# EAGLE design 10-de-77 (EAGLE 6.6.0)
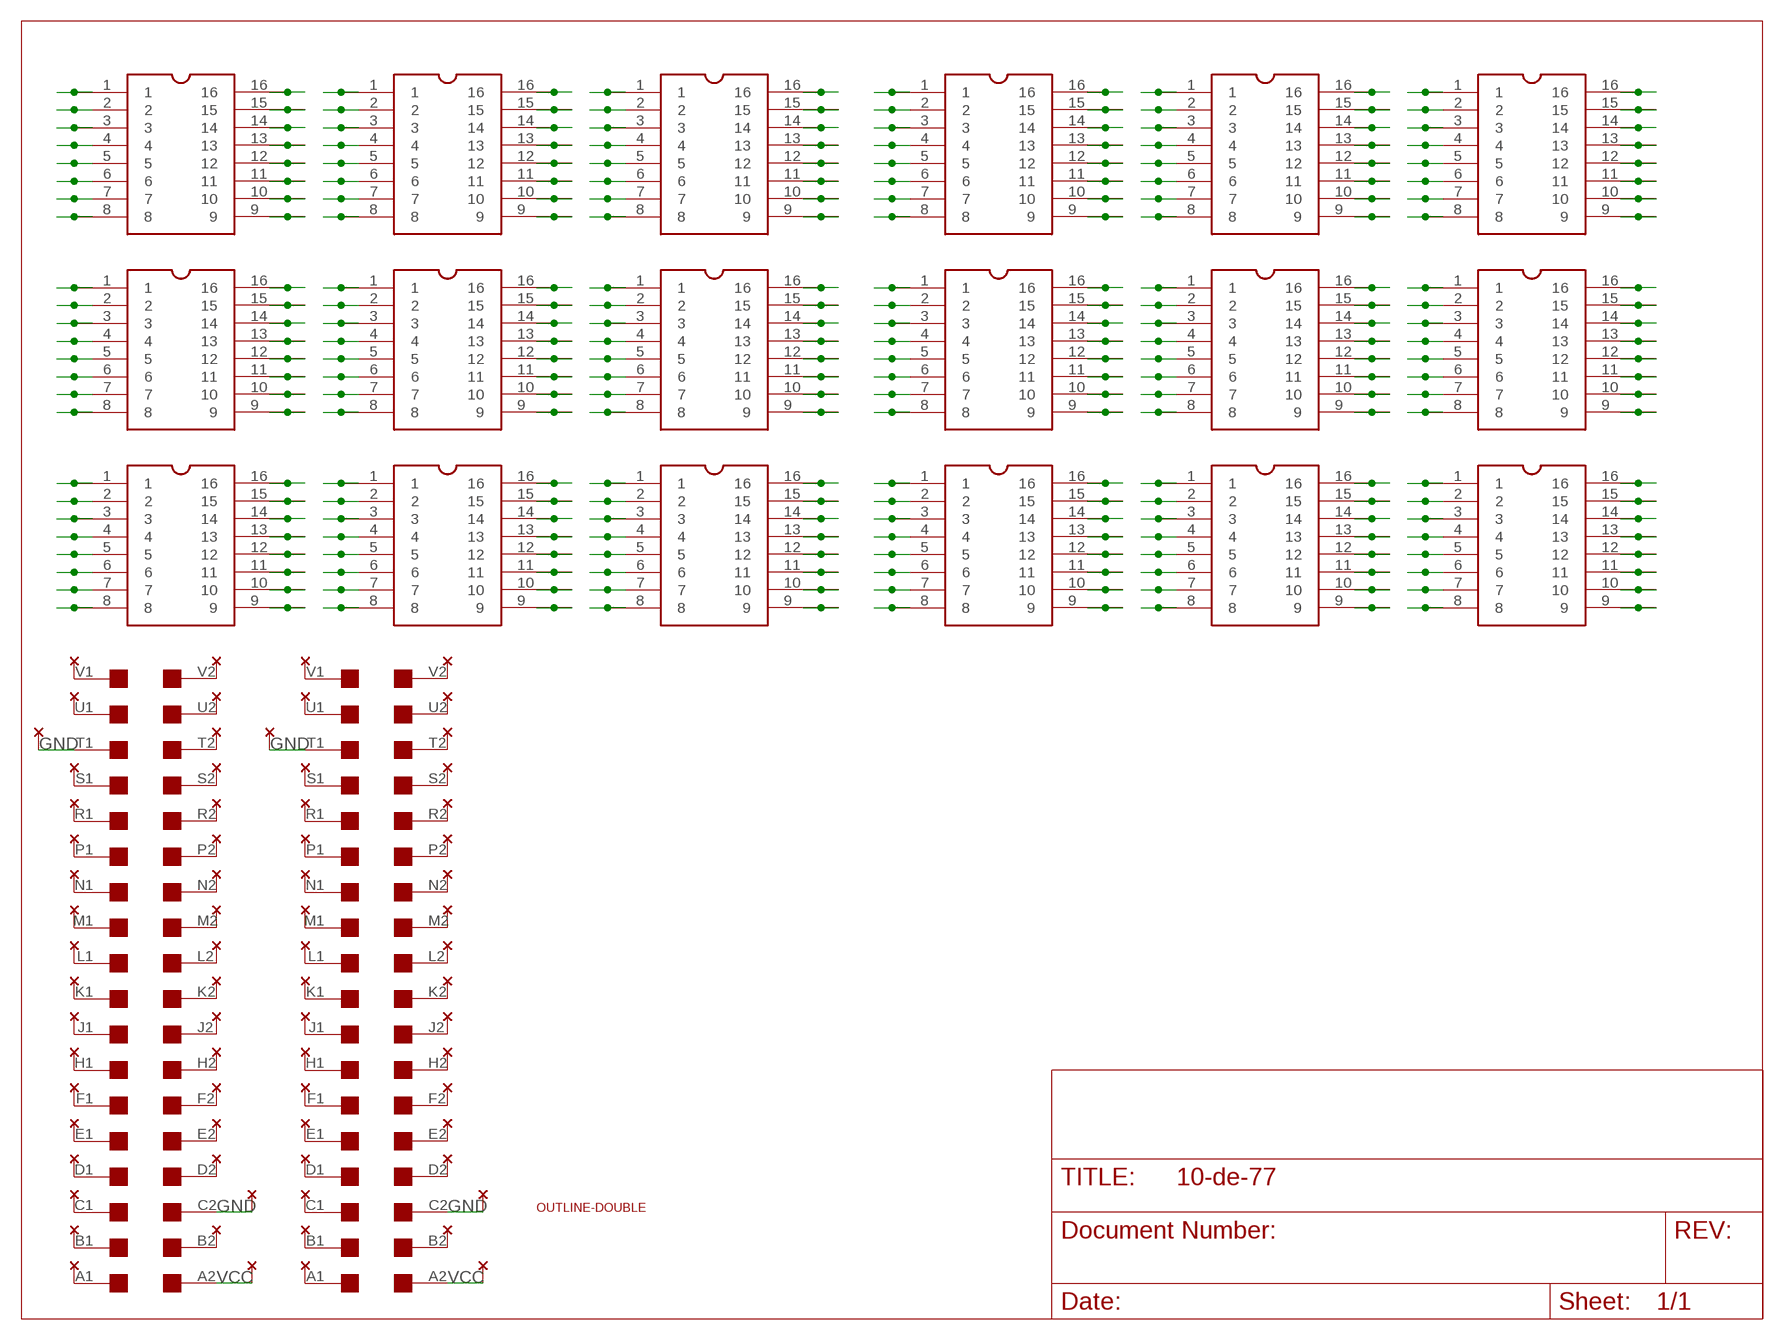
[diagram p0: schematic, sheet 1]

## Parts
U$1  SINGLE  [EDGE-CON2]
U$4  OUTLINE-DOUBLE  [DOUBLE]
U$5  DIL16PROTO  [DIL16PROTO]
U$6  SINGLE  [EDGE-CON2]
U$7  DIL16PROTO  [DIL16PROTO]
U$8  DIL16PROTO  [DIL16PROTO]
U$9  DIL16PROTO  [DIL16PROTO]
U$10  DIL16PROTO  [DIL16PROTO]
U$11  DIL16PROTO  [DIL16PROTO]
U$12  DIL16PROTO  [DIL16PROTO]
U$13  DIL16PROTO  [DIL16PROTO]
U$14  DIL16PROTO  [DIL16PROTO]
U$15  DIL16PROTO  [DIL16PROTO]
U$16  DIL16PROTO  [DIL16PROTO]
U$17  DIL16PROTO  [DIL16PROTO]
U$18  DIL16PROTO  [DIL16PROTO]
U$19  DIL16PROTO  [DIL16PROTO]
U$20  DIL16PROTO  [DIL16PROTO]
U$21  DIL16PROTO  [DIL16PROTO]
U$22  DIL16PROTO  [DIL16PROTO]
U$23  DIL16PROTO  [DIL16PROTO]
U$24  THRU-HOLE1A  [THRU-HOLE1A]
U$25  THRU-HOLE1A  [THRU-HOLE1A]
U$26  THRU-HOLE1A  [THRU-HOLE1A]
U$27  THRU-HOLE1A  [THRU-HOLE1A]

## Nets
GND: U$1.C2 U$1.T1 U$6.C2 U$6.T1 U$24.T1 U$25.C1 U$26.T1 U$27.C1
N$1: U$1.K2 U$25.K1
N$2: U$1.J2 U$25.J1
N$3: U$1.H2 U$25.H1
N$4: U$1.L2 U$25.L1
N$5: U$1.M2 U$25.M1
N$6: U$1.N2 U$25.N1
N$7: U$1.P2 U$25.P1
N$8: U$1.F2 U$25.F1
N$9: U$1.E2 U$25.E1
N$10: U$1.D2 U$25.D1
N$12: U$1.R2 U$25.R1
N$13: U$1.S2 U$25.S1
N$14: U$1.B2 U$25.B1
N$16: U$1.T2 U$25.T1
N$17: U$1.U2 U$25.U1
N$18: U$1.V2 U$25.V1
N$19: U$1.A1 U$24.A1
N$20: U$1.V1 U$24.V1
N$21: U$1.U1 U$24.U1
N$23: U$1.S1 U$24.S1
N$24: U$1.R1 U$24.R1
N$25: U$1.P1 U$24.P1
N$26: U$1.N1 U$24.N1
N$27: U$1.M1 U$24.M1
N$28: U$1.L1 U$24.L1
N$29: U$1.K1 U$24.K1
N$30: U$1.J1 U$24.J1
N$31: U$1.H1 U$24.H1
N$32: U$1.F1 U$24.F1
N$33: U$1.E1 U$24.E1
N$34: U$1.D1 U$24.D1
N$35: U$1.C1 U$24.C1
N$36: U$1.B1 U$24.B1
N$37: U$6.K2 U$27.K1
N$38: U$6.J2 U$27.J1
N$39: U$6.H2 U$27.H1
N$40: U$6.L2 U$27.L1
N$41: U$6.M2 U$27.M1
N$42: U$6.N2 U$27.N1
N$43: U$6.P2 U$27.P1
N$44: U$6.F2 U$27.F1
N$45: U$6.E2 U$27.E1
N$46: U$6.D2 U$27.D1
N$48: U$6.R2 U$27.R1
N$49: U$6.S2 U$27.S1
N$50: U$6.B2 U$27.B1
N$52: U$6.T2 U$27.T1
N$53: U$6.U2 U$27.U1
N$54: U$6.V2 U$27.V1
N$55: U$6.A1 U$26.A1
N$56: U$6.V1 U$26.V1
N$57: U$6.U1 U$26.U1
N$59: U$6.S1 U$26.S1
N$60: U$6.R1 U$26.R1
N$61: U$6.P1 U$26.P1
N$62: U$6.N1 U$26.N1
N$63: U$6.M1 U$26.M1
N$64: U$6.L1 U$26.L1
N$65: U$6.K1 U$26.K1
N$66: U$6.J1 U$26.J1
N$67: U$6.H1 U$26.H1
N$68: U$6.F1 U$26.F1
N$69: U$6.E1 U$26.E1
N$70: U$6.D1 U$26.D1
N$71: U$6.C1 U$26.C1
N$72: U$6.B1 U$26.B1
N$73: U$5.1 U$5.1@2 U$5.1@3
N$74: U$5.4 U$5.4@2 U$5.4@3
N$75: U$5.2 U$5.2@2 U$5.2@3
N$76: U$5.3 U$5.3@2 U$5.3@3
N$77: U$5.5 U$5.5@2 U$5.5@3
N$78: U$5.6 U$5.6@2 U$5.6@3
N$79: U$5.7 U$5.7@2 U$5.7@3
N$80: U$5.8 U$5.8@2 U$5.8@3
N$81: U$5.16 U$5.16@2 U$5.16@3
N$82: U$5.15 U$5.15@2 U$5.15@3
N$83: U$5.14 U$5.14@2 U$5.14@3
N$84: U$5.13 U$5.13@2 U$5.13@3
N$85: U$5.12 U$5.12@2 U$5.12@3
N$86: U$5.11 U$5.11@2 U$5.11@3
N$87: U$5.10 U$5.10@2 U$5.10@3
N$88: U$5.9 U$5.9@2 U$5.9@3
N$89: U$7.1 U$7.1@2 U$7.1@3
N$90: U$7.2 U$7.2@2 U$7.2@3
N$91: U$7.3 U$7.3@2 U$7.3@3
N$92: U$7.4 U$7.4@2 U$7.4@3
N$93: U$7.5 U$7.5@2 U$7.5@3
N$94: U$7.6 U$7.6@2 U$7.6@3
N$95: U$7.7 U$7.7@2 U$7.7@3
N$96: U$7.8 U$7.8@2 U$7.8@3
N$97: U$7.16 U$7.16@2 U$7.16@3
N$98: U$7.15 U$7.15@2 U$7.15@3
N$99: U$7.14 U$7.14@2 U$7.14@3
N$100: U$7.13 U$7.13@2 U$7.13@3
N$101: U$7.12 U$7.12@2 U$7.12@3
N$102: U$7.11 U$7.11@2 U$7.11@3
N$103: U$7.10 U$7.10@2 U$7.10@3
N$104: U$7.9 U$7.9@2 U$7.9@3
N$105: U$8.1 U$8.1@2 U$8.1@3
N$106: U$8.2 U$8.2@2 U$8.2@3
N$107: U$8.3 U$8.3@2 U$8.3@3
N$108: U$8.4 U$8.4@2 U$8.4@3
N$109: U$8.5 U$8.5@2 U$8.5@3
N$110: U$8.6 U$8.6@2 U$8.6@3
N$111: U$8.7 U$8.7@2 U$8.7@3
N$112: U$8.8 U$8.8@2 U$8.8@3
N$113: U$8.16 U$8.16@2 U$8.16@3
N$114: U$8.15 U$8.15@2 U$8.15@3
N$115: U$8.14 U$8.14@2 U$8.14@3
N$116: U$8.13 U$8.13@2 U$8.13@3
N$117: U$8.12 U$8.12@2 U$8.12@3
N$118: U$8.11 U$8.11@2 U$8.11@3
N$119: U$8.10 U$8.10@2 U$8.10@3
N$120: U$8.9 U$8.9@2 U$8.9@3
N$121: U$9.1 U$9.1@2 U$9.1@3
N$122: U$9.2 U$9.2@2 U$9.2@3
N$123: U$9.3 U$9.3@2 U$9.3@3
N$124: U$9.4 U$9.4@2 U$9.4@3
N$125: U$9.5 U$9.5@2 U$9.5@3
N$126: U$9.6 U$9.6@2 U$9.6@3
N$127: U$9.7 U$9.7@2 U$9.7@3
N$128: U$9.8 U$9.8@2 U$9.8@3
N$129: U$9.16 U$9.16@2 U$9.16@3
N$130: U$9.15 U$9.15@2 U$9.15@3
N$131: U$9.14 U$9.14@2 U$9.14@3
N$132: U$9.13 U$9.13@2 U$9.13@3
N$133: U$9.12 U$9.12@2 U$9.12@3
N$134: U$9.11 U$9.11@2 U$9.11@3
N$135: U$9.10 U$9.10@2 U$9.10@3
N$136: U$9.9 U$9.9@2 U$9.9@3
N$137: U$10.1 U$10.1@2 U$10.1@3
N$138: U$10.2 U$10.2@2 U$10.2@3
N$139: U$10.3 U$10.3@2 U$10.3@3
N$140: U$10.4 U$10.4@2 U$10.4@3
N$141: U$10.5 U$10.5@2 U$10.5@3
N$142: U$10.6 U$10.6@2 U$10.6@3
N$143: U$10.7 U$10.7@2 U$10.7@3
N$144: U$10.8 U$10.8@2 U$10.8@3
N$145: U$10.16 U$10.16@2 U$10.16@3
N$146: U$10.15 U$10.15@2 U$10.15@3
N$147: U$10.14 U$10.14@2 U$10.14@3
N$148: U$10.13 U$10.13@2 U$10.13@3
N$149: U$10.12 U$10.12@2 U$10.12@3
N$150: U$10.11 U$10.11@2 U$10.11@3
N$151: U$10.10 U$10.10@2 U$10.10@3
N$152: U$10.9 U$10.9@2 U$10.9@3
N$153: U$11.1 U$11.1@2 U$11.1@3
N$154: U$11.2 U$11.2@2 U$11.2@3
N$155: U$11.3 U$11.3@2 U$11.3@3
N$156: U$11.4 U$11.4@2 U$11.4@3
N$157: U$11.5 U$11.5@2 U$11.5@3
N$158: U$11.6 U$11.6@2 U$11.6@3
N$159: U$11.7 U$11.7@2 U$11.7@3
N$160: U$11.8 U$11.8@2 U$11.8@3
N$161: U$11.16 U$11.16@2 U$11.16@3
N$162: U$11.15 U$11.15@2 U$11.15@3
N$163: U$11.14 U$11.14@2 U$11.14@3
N$164: U$11.13 U$11.13@2 U$11.13@3
N$165: U$11.12 U$11.12@2 U$11.12@3
N$166: U$11.11 U$11.11@2 U$11.11@3
N$167: U$11.10 U$11.10@2 U$11.10@3
N$168: U$11.9 U$11.9@2 U$11.9@3
N$169: U$12.1 U$12.1@2 U$12.1@3
N$170: U$12.2 U$12.2@2 U$12.2@3
N$171: U$12.3 U$12.3@2 U$12.3@3
N$172: U$12.4 U$12.4@2 U$12.4@3
N$173: U$12.5 U$12.5@2 U$12.5@3
N$174: U$12.6 U$12.6@2 U$12.6@3
N$175: U$12.7 U$12.7@2 U$12.7@3
N$176: U$12.8 U$12.8@2 U$12.8@3
N$177: U$12.16 U$12.16@2 U$12.16@3
N$178: U$12.15 U$12.15@2 U$12.15@3
N$179: U$12.14 U$12.14@2 U$12.14@3
N$180: U$12.13 U$12.13@2 U$12.13@3
N$181: U$12.12 U$12.12@2 U$12.12@3
N$182: U$12.11 U$12.11@2 U$12.11@3
N$183: U$12.10 U$12.10@2 U$12.10@3
N$184: U$12.9 U$12.9@2 U$12.9@3
N$185: U$13.1 U$13.1@2 U$13.1@3
N$186: U$13.2 U$13.2@2 U$13.2@3
N$187: U$13.3 U$13.3@2 U$13.3@3
N$188: U$13.4 U$13.4@2 U$13.4@3
N$189: U$13.5 U$13.5@2 U$13.5@3
N$190: U$13.6 U$13.6@2 U$13.6@3
N$191: U$13.7 U$13.7@2 U$13.7@3
N$192: U$13.8 U$13.8@2 U$13.8@3
N$193: U$13.16 U$13.16@2 U$13.16@3
N$194: U$13.15 U$13.15@2 U$13.15@3
N$195: U$13.14 U$13.14@2 U$13.14@3
N$196: U$13.13 U$13.13@2 U$13.13@3
N$197: U$13.12 U$13.12@2 U$13.12@3
N$198: U$13.11 U$13.11@2 U$13.11@3
N$199: U$13.10 U$13.10@2 U$13.10@3
N$200: U$13.9 U$13.9@2 U$13.9@3
N$201: U$14.1 U$14.1@2 U$14.1@3
N$202: U$14.2 U$14.2@2 U$14.2@3
N$203: U$14.3 U$14.3@2 U$14.3@3
N$204: U$14.4 U$14.4@2 U$14.4@3
N$205: U$14.5 U$14.5@2 U$14.5@3
N$206: U$14.6 U$14.6@2 U$14.6@3
N$207: U$14.7 U$14.7@2 U$14.7@3
N$208: U$14.8 U$14.8@2 U$14.8@3
N$209: U$14.16 U$14.16@2 U$14.16@3
N$210: U$14.15 U$14.15@2 U$14.15@3
N$211: U$14.14 U$14.14@2 U$14.14@3
N$212: U$14.13 U$14.13@2 U$14.13@3
N$213: U$14.12 U$14.12@2 U$14.12@3
N$214: U$14.11 U$14.11@2 U$14.11@3
N$215: U$14.10 U$14.10@2 U$14.10@3
N$216: U$14.9 U$14.9@2 U$14.9@3
N$217: U$15.1 U$15.1@2 U$15.1@3
N$218: U$15.2 U$15.2@2 U$15.2@3
N$219: U$15.3 U$15.3@2 U$15.3@3
N$220: U$15.4 U$15.4@2 U$15.4@3
N$221: U$15.5 U$15.5@2 U$15.5@3
N$222: U$15.6 U$15.6@2 U$15.6@3
N$223: U$15.7 U$15.7@2 U$15.7@3
N$224: U$15.8 U$15.8@2 U$15.8@3
N$225: U$15.16 U$15.16@2 U$15.16@3
N$226: U$15.15 U$15.15@2 U$15.15@3
N$227: U$15.14 U$15.14@2 U$15.14@3
N$228: U$15.13 U$15.13@2 U$15.13@3
N$229: U$15.12 U$15.12@2 U$15.12@3
N$230: U$15.11 U$15.11@2 U$15.11@3
N$231: U$15.10 U$15.10@2 U$15.10@3
N$232: U$15.9 U$15.9@2 U$15.9@3
N$233: U$16.1 U$16.1@2 U$16.1@3
N$234: U$16.2 U$16.2@2 U$16.2@3
N$235: U$16.3 U$16.3@2 U$16.3@3
N$236: U$16.4 U$16.4@2 U$16.4@3
N$237: U$16.5 U$16.5@2 U$16.5@3
N$238: U$16.6 U$16.6@2 U$16.6@3
N$239: U$16.7 U$16.7@2 U$16.7@3
N$240: U$16.8 U$16.8@2 U$16.8@3
N$241: U$16.16 U$16.16@2 U$16.16@3
N$242: U$16.15 U$16.15@2 U$16.15@3
N$243: U$16.14 U$16.14@2 U$16.14@3
N$244: U$16.13 U$16.13@2 U$16.13@3
N$245: U$16.12 U$16.12@2 U$16.12@3
N$246: U$16.11 U$16.11@2 U$16.11@3
N$247: U$16.10 U$16.10@2 U$16.10@3
N$248: U$16.9 U$16.9@2 U$16.9@3
N$249: U$17.1 U$17.1@2 U$17.1@3
N$250: U$17.2 U$17.2@2 U$17.2@3
N$251: U$17.3 U$17.3@2 U$17.3@3
N$252: U$17.4 U$17.4@2 U$17.4@3
N$253: U$17.5 U$17.5@2 U$17.5@3
N$254: U$17.6 U$17.6@2 U$17.6@3
N$255: U$17.7 U$17.7@2 U$17.7@3
N$256: U$17.8 U$17.8@2 U$17.8@3
N$257: U$17.16 U$17.16@2 U$17.16@3
N$258: U$17.15 U$17.15@2 U$17.15@3
N$259: U$17.14 U$17.14@2 U$17.14@3
N$260: U$17.13 U$17.13@2 U$17.13@3
N$261: U$17.12 U$17.12@2 U$17.12@3
N$262: U$17.11 U$17.11@2 U$17.11@3
N$263: U$17.10 U$17.10@2 U$17.10@3
N$264: U$17.9 U$17.9@2 U$17.9@3
N$265: U$18.1 U$18.1@2 U$18.1@3
N$266: U$18.2 U$18.2@2 U$18.2@3
N$267: U$18.3 U$18.3@2 U$18.3@3
N$268: U$18.4 U$18.4@2 U$18.4@3
N$269: U$18.5 U$18.5@2 U$18.5@3
N$270: U$18.6 U$18.6@2 U$18.6@3
N$271: U$18.7 U$18.7@2 U$18.7@3
N$272: U$18.8 U$18.8@2 U$18.8@3
N$273: U$18.16 U$18.16@2 U$18.16@3
N$274: U$18.15 U$18.15@2 U$18.15@3
N$275: U$18.14 U$18.14@2 U$18.14@3
N$276: U$18.13 U$18.13@2 U$18.13@3
N$277: U$18.12 U$18.12@2 U$18.12@3
N$278: U$18.11 U$18.11@2 U$18.11@3
N$279: U$18.10 U$18.10@2 U$18.10@3
N$280: U$18.9 U$18.9@2 U$18.9@3
N$281: U$19.1 U$19.1@2 U$19.1@3
N$282: U$19.2 U$19.2@2 U$19.2@3
N$283: U$19.3 U$19.3@2 U$19.3@3
N$284: U$19.4 U$19.4@2 U$19.4@3
N$285: U$19.5 U$19.5@2 U$19.5@3
N$286: U$19.6 U$19.6@2 U$19.6@3
N$287: U$19.7 U$19.7@2 U$19.7@3
N$288: U$19.8 U$19.8@2 U$19.8@3
N$289: U$19.16 U$19.16@2 U$19.16@3
N$290: U$19.15 U$19.15@2 U$19.15@3
N$291: U$19.14 U$19.14@2 U$19.14@3
N$292: U$19.13 U$19.13@2 U$19.13@3
N$293: U$19.12 U$19.12@2 U$19.12@3
N$294: U$19.11 U$19.11@2 U$19.11@3
N$295: U$19.10 U$19.10@2 U$19.10@3
N$296: U$19.9 U$19.9@2 U$19.9@3
N$297: U$20.1 U$20.1@2 U$20.1@3
N$298: U$20.2 U$20.2@2 U$20.2@3
N$299: U$20.3 U$20.3@2 U$20.3@3
N$300: U$20.4 U$20.4@2 U$20.4@3
N$301: U$20.5 U$20.5@2 U$20.5@3
N$302: U$20.6 U$20.6@2 U$20.6@3
N$303: U$20.7 U$20.7@2 U$20.7@3
N$304: U$20.8 U$20.8@2 U$20.8@3
N$305: U$20.16 U$20.16@2 U$20.16@3
N$306: U$20.15 U$20.15@2 U$20.15@3
N$307: U$20.14 U$20.14@2 U$20.14@3
N$308: U$20.13 U$20.13@2 U$20.13@3
N$309: U$20.12 U$20.12@2 U$20.12@3
N$310: U$20.11 U$20.11@2 U$20.11@3
N$311: U$20.10 U$20.10@2 U$20.10@3
N$312: U$20.9 U$20.9@2 U$20.9@3
N$313: U$21.1 U$21.1@2 U$21.1@3
N$314: U$21.2 U$21.2@2 U$21.2@3
N$315: U$21.3 U$21.3@2 U$21.3@3
N$316: U$21.4 U$21.4@2 U$21.4@3
N$317: U$21.5 U$21.5@2 U$21.5@3
N$318: U$21.6 U$21.6@2 U$21.6@3
N$319: U$21.7 U$21.7@2 U$21.7@3
N$320: U$21.8 U$21.8@2 U$21.8@3
N$321: U$21.16 U$21.16@2 U$21.16@3
N$322: U$21.15 U$21.15@2 U$21.15@3
N$323: U$21.14 U$21.14@2 U$21.14@3
N$324: U$21.13 U$21.13@2 U$21.13@3
N$325: U$21.12 U$21.12@2 U$21.12@3
N$326: U$21.11 U$21.11@2 U$21.11@3
N$327: U$21.10 U$21.10@2 U$21.10@3
N$328: U$21.9 U$21.9@2 U$21.9@3
N$329: U$22.1 U$22.1@2 U$22.1@3
N$330: U$22.2 U$22.2@2 U$22.2@3
N$331: U$22.3 U$22.3@2 U$22.3@3
N$332: U$22.4 U$22.4@2 U$22.4@3
N$333: U$22.5 U$22.5@2 U$22.5@3
N$334: U$22.6 U$22.6@2 U$22.6@3
N$335: U$22.7 U$22.7@2 U$22.7@3
N$336: U$22.8 U$22.8@2 U$22.8@3
N$337: U$22.16 U$22.16@2 U$22.16@3
N$338: U$22.15 U$22.15@2 U$22.15@3
N$339: U$22.14 U$22.14@2 U$22.14@3
N$340: U$22.13 U$22.13@2 U$22.13@3
N$341: U$22.12 U$22.12@2 U$22.12@3
N$342: U$22.11 U$22.11@2 U$22.11@3
N$343: U$22.10 U$22.10@2 U$22.10@3
N$344: U$22.9 U$22.9@2 U$22.9@3
N$345: U$23.1 U$23.1@2 U$23.1@3
N$346: U$23.2 U$23.2@2 U$23.2@3
N$347: U$23.3 U$23.3@2 U$23.3@3
N$348: U$23.4 U$23.4@2 U$23.4@3
N$349: U$23.5 U$23.5@2 U$23.5@3
N$350: U$23.6 U$23.6@2 U$23.6@3
N$351: U$23.7 U$23.7@2 U$23.7@3
N$352: U$23.8 U$23.8@2 U$23.8@3
N$353: U$23.16 U$23.16@2 U$23.16@3
N$354: U$23.15 U$23.15@2 U$23.15@3
N$355: U$23.14 U$23.14@2 U$23.14@3
N$356: U$23.13 U$23.13@2 U$23.13@3
N$357: U$23.12 U$23.12@2 U$23.12@3
N$358: U$23.11 U$23.11@2 U$23.11@3
N$359: U$23.10 U$23.10@2 U$23.10@3
N$360: U$23.9 U$23.9@2 U$23.9@3
VCC: U$1.A2 U$6.A2 U$25.A1 U$27.A1

## Library data of the parts
U$1 U$6 = dec-con:SINGLE: Single-Height DEC board
U$4 = dec-con:OUTLINE-*: Board outlines for DEC boards.
U$5 U$7-U$23 = dec-con:DIL16PROTO: DIL 16 with prototypyng pads
U$24-U$27 = dec-con:THRU-HOLE1A

## Net classes
0 default: width 0.635 mm

## Board
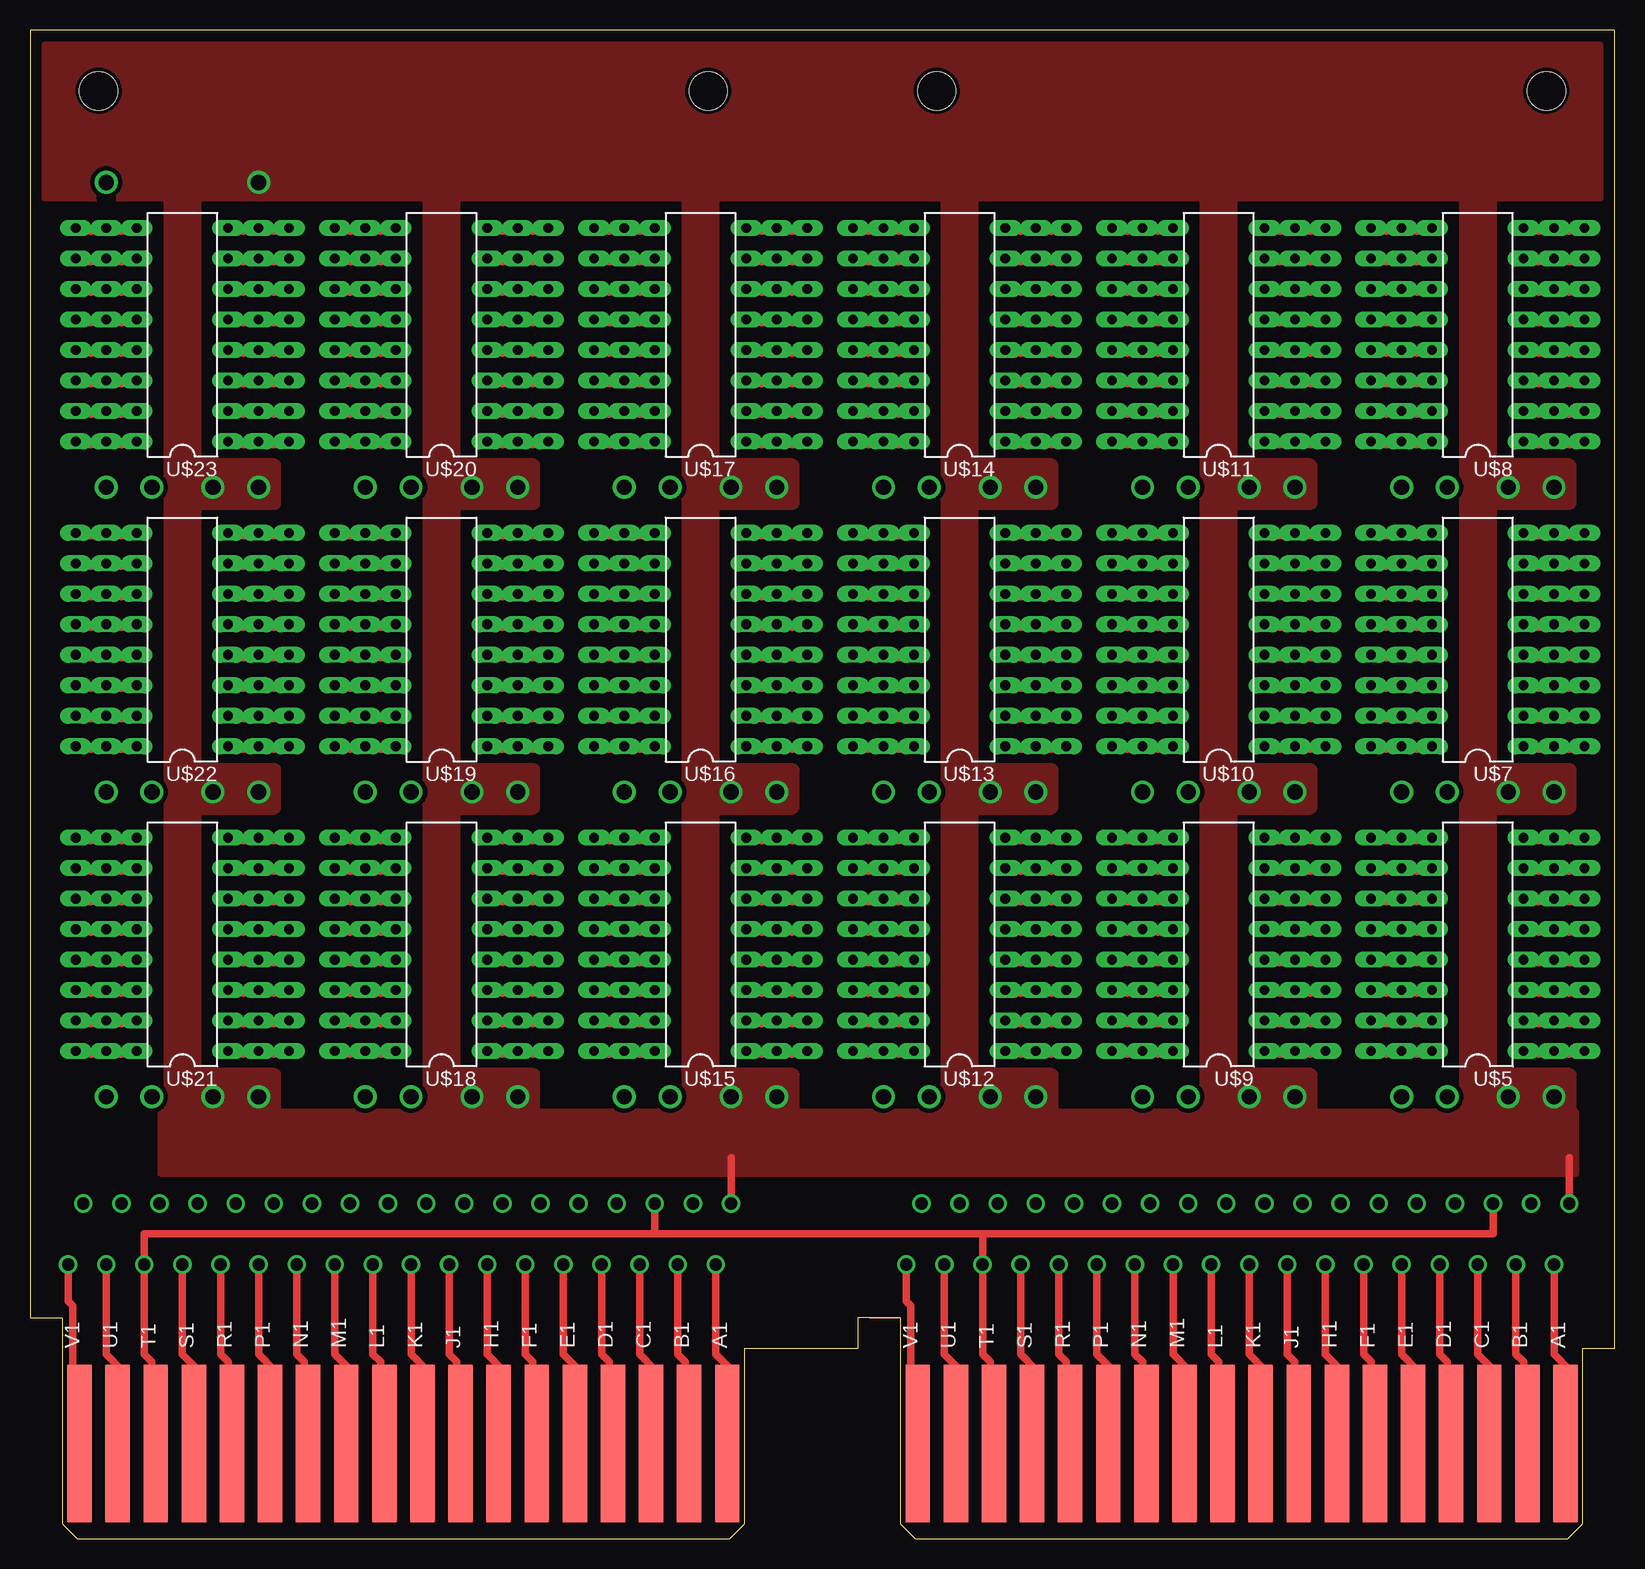
[diagram p1: board, top side]
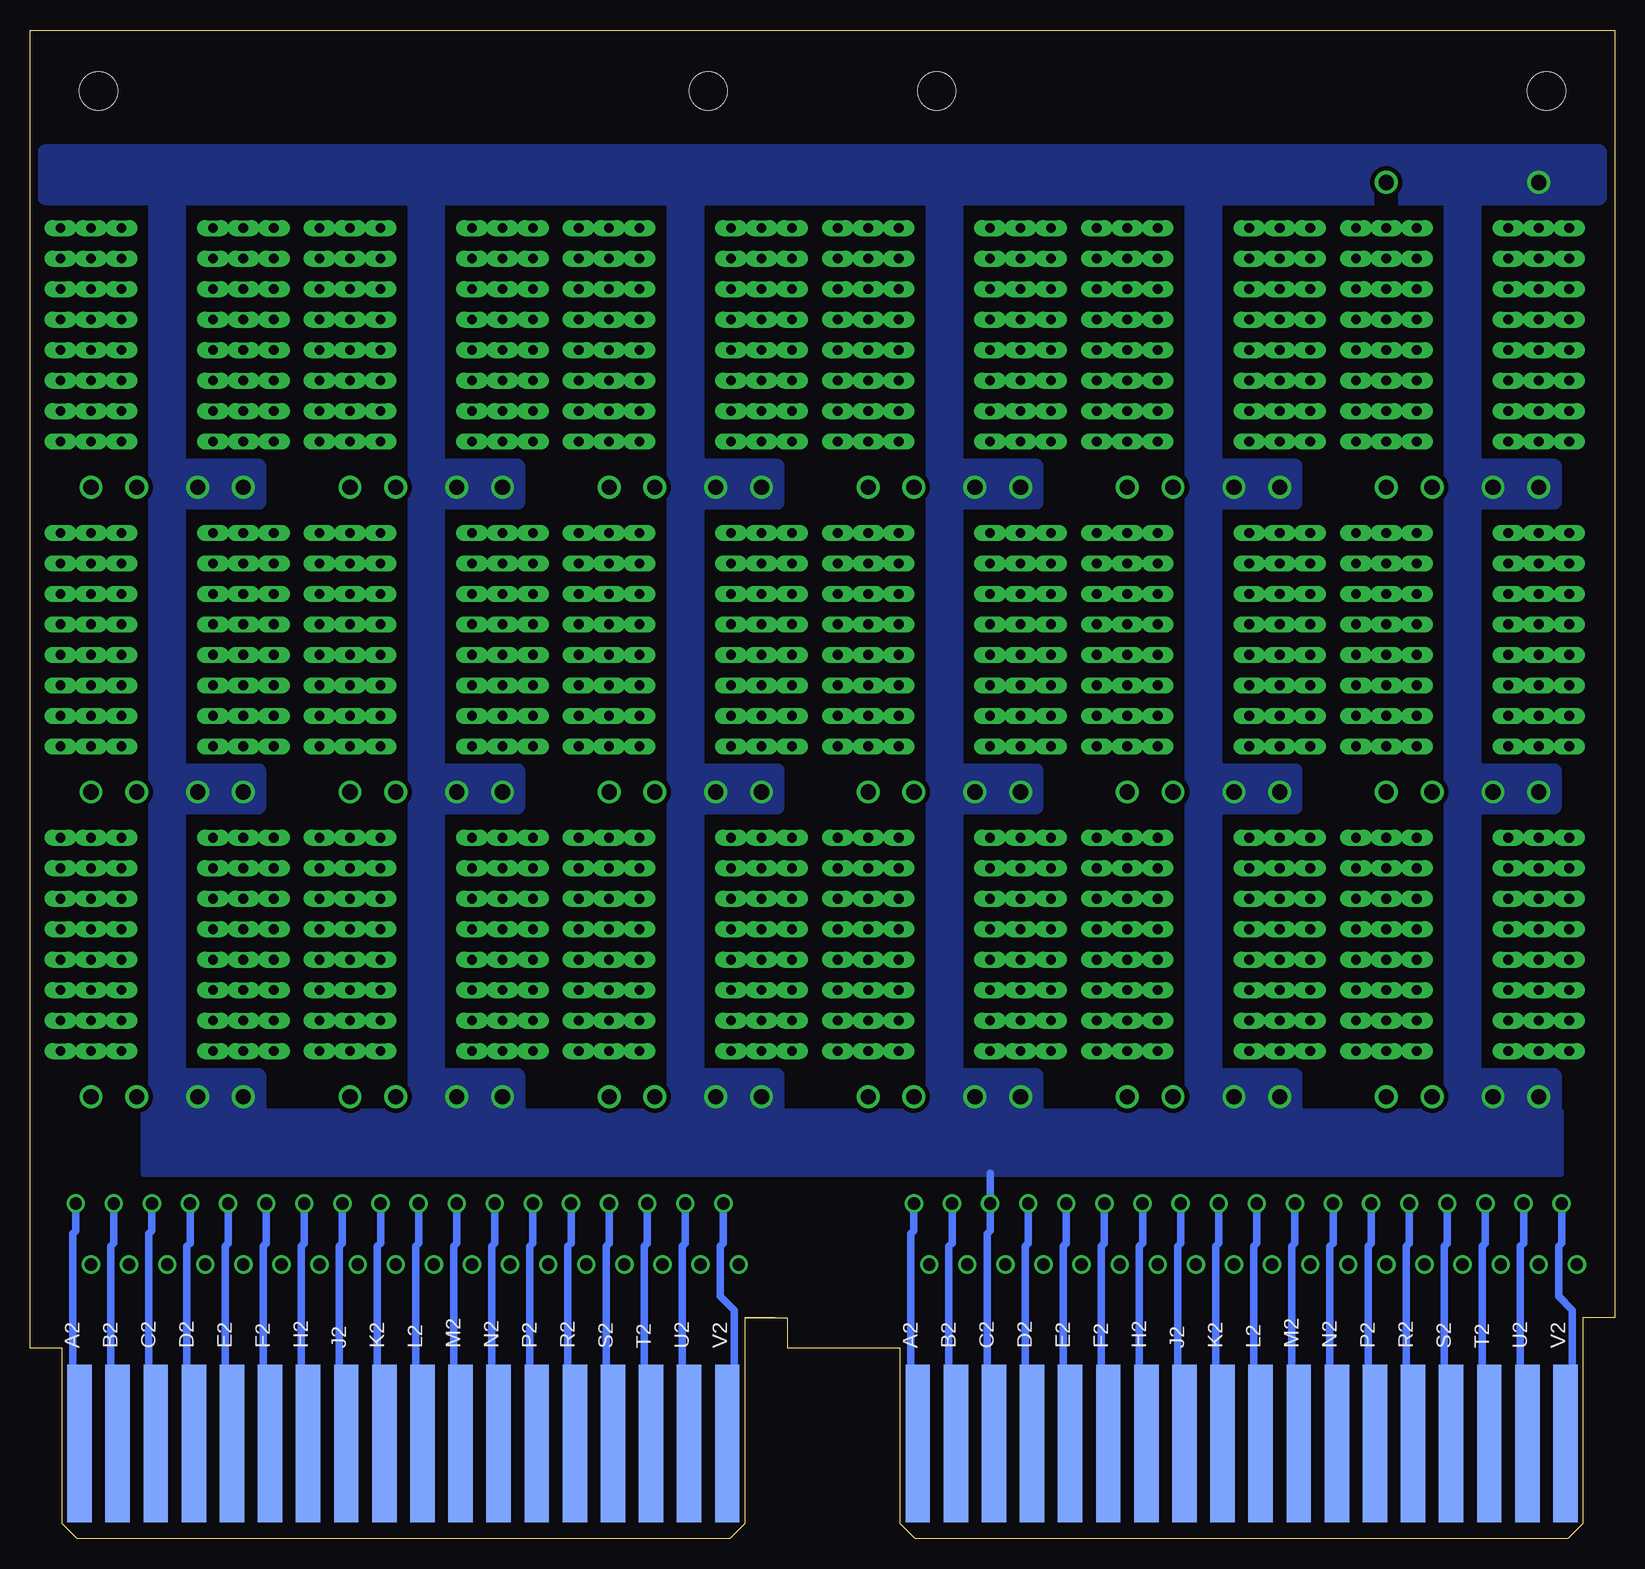
[diagram p2: board, bottom side, seen from below]

Size 132.08 x 125.73 mm. Coordinates in mm from the lower left corner, seen from the top.
Copper layers (1+16): Top 0.035mm / dielectric 1.5mm / Bottom 0.035mm
Design rules "16mils": minimum track width 16mil, minimum drill 32mil, track to track 15mil, track to pad 10mil, pad to pad 10mil, via to via 10mil, smd to smd 10mil, copper to edge 13mil, drill to drill 10mil, minimum pad ring 10mil, minimum via ring 8mil, stop-mask expansion 0mil, vias tented up to drill 0mil, thermal gap 10mil

### Footprints (pad centres in the part's own frame; a part is rotated, then mirrored left to right if it is on the bottom)
EDGE-CON2 = smd 13.106 x 2.032: A1 7.938,4.128; B1 7.938,7.303; C1 7.938,10.477; D1 7.938,13.652; E1 7.938,16.828; F1 7.938,20.003; H1 7.938,23.177; J1 7.938,26.352; K1 7.938,29.527; L1 7.938,32.703; M1 7.938,35.877; N1 7.938,39.053; P1 7.938,42.227; R1 7.938,45.403; S1 7.938,48.578; T1 7.938,51.752; U1 7.938,54.928; V1 7.938,58.102 | smd 13.106 x 2.032 bottom: A2 7.938,4.128; B2 7.938,7.303; C2 7.938,10.477; D2 7.938,13.652; E2 7.938,16.828; F2 7.938,20.003; H2 7.938,23.177; J2 7.938,26.352; K2 7.938,29.527; L2 7.938,32.703; M2 7.938,35.877; N2 7.938,39.053; P2 7.938,42.227; R2 7.938,45.403; S2 7.938,48.578; T2 7.938,51.752; U2 7.938,54.928; V2 7.938,58.102
DOUBLE = hole 3.175: 120.65,56.515; 120.65,5.715; 120.65,75.565; 120.65,126.365
DIL16PROTO = drill 0.813 long: 1 -8.89,-3.81; 1@2 -8.89,-6.35; 1@3 -8.89,-8.89; 2 -6.35,-3.81; 2@2 -6.35,-6.35; 2@3 -6.35,-8.89; 3 -3.81,-3.81; 3@2 -3.81,-6.35; 3@3 -3.81,-8.89; 4 -1.27,-3.81; 4@2 -1.27,-6.35; 4@3 -1.27,-8.89; 5 1.27,-3.81; 5@2 1.27,-6.35; 5@3 1.27,-8.89; 6 3.81,-3.81; 6@2 3.81,-6.35; 6@3 3.81,-8.89; 7 6.35,-3.81; 7@2 6.35,-6.35; 7@3 6.35,-8.89; 8 8.89,-3.81; 8@2 8.89,-6.35; 8@3 8.89,-8.89; 9 8.89,3.81; 9@2 8.89,6.35; 9@3 8.89,8.89; 10 6.35,3.81; 10@2 6.35,6.35; 10@3 6.35,8.89; 11 3.81,3.81; 11@2 3.81,6.35; 11@3 3.81,8.89; 12 1.27,3.81; 12@2 1.27,6.35; 12@3 1.27,8.89; 13 -1.27,3.81; 13@2 -1.27,6.35; 13@3 -1.27,8.89; 14 -3.81,3.81; 14@2 -3.81,6.35; 14@3 -3.81,8.89; 15 -6.35,3.81; 15@2 -6.35,6.35; 15@3 -6.35,8.89; 16 -8.89,3.81; 16@2 -8.89,6.35; 16@3 -8.89,8.89
THRU-HOLE1A = drill 1.016 pad 1.27: A1 0,-28.575; B1 0,-25.4; C1 0,-22.225; D1 0,-19.05; E1 0,-15.875; F1 0,-12.7; H1 0,-9.525; J1 0,-6.35; K1 0,-3.175; L1 0,0; M1 0,3.175; N1 0,6.35; P1 0,9.525; R1 0,12.7; S1 0,15.875; T1 0,19.05; U1 0,22.225; V1 0,25.4

### Placement (x,y rotation side)
U$1  62.23,0 90 top
U$4  132.08,0 90 top
U$5  120.65,49.53 90 top
U$6  132.08,0 90 top
U$7  120.65,74.93 90 top
U$8  120.65,100.33 90 top
U$9  99.06,49.53 90 top
U$10  99.06,74.93 90 top
U$11  99.06,100.33 90 top
U$12  77.47,49.53 90 top
U$13  77.47,74.93 90 top
U$14  77.47,100.33 90 top
U$15  55.88,49.53 90 top
U$16  55.88,74.93 90 top
U$17  55.88,100.33 90 top
U$18  34.29,49.53 90 top
U$19  34.29,74.93 90 top
U$20  34.29,100.33 90 top
U$21  12.7,49.53 90 top
U$22  12.7,74.93 90 top
U$23  12.7,100.33 90 top
U$24  28.57,22.86 90 top
U$25  29.84,27.94 90 top
U$26  98.42,22.86 90 top
U$27  99.69,27.94 90 top

### Tracks (layer width: path | path; a pad name or v marks a point on that pad's centre or on a via)
GND  (via drill 1.27)
  Top 0.635: 52.07,25.4 9.53,25.4 U$24.T1 9.53,15.37 10.16,14.73 10.16,12.7 U$1.T1 | 52.07,25.4 79.38,25.4 | 79.38,25.4 121.92,25.4 U$27.C1 | 52.07,25.4 U$25.C1 | 79.38,25.4 U$26.T1 79.38,15.37 80.01,14.73 80.01,13.97 U$6.T1
  Bottom 0.635: U$1.C2 52.32,14.1 52.32,25.4 52.07,25.65 U$25.C1 52.07,30.48 | U$6.C2 122.17,14.1 122.17,25.4 121.92,25.65 U$27.C1
  other vias: 10.16,87.63 6.35,87.63 6.35,62.23 10.16,62.23 10.16,36.83 6.35,36.83 31.75,62.23 27.94,62.23 31.75,36.83 27.94,36.83 27.94,87.63 31.75,87.63 49.53,87.63 53.34,87.63 53.34,62.23 49.53,62.23 53.34,36.83 49.53,36.83 74.93,36.83 71.12,36.83 74.93,62.23 71.12,62.23 71.12,87.63 74.93,87.63 96.52,87.63 92.71,87.63 96.52,62.23 92.71,62.23 96.52,36.83 92.71,36.83 118.11,36.83 114.3,36.83 118.11,62.23 114.3,62.23 114.3,87.63 118.11,87.63 6.35,113.03
  pour Bottom: 119.38,35.56 118.11,36.83 119.38,38.1 119.38,113.03 121.92,113.03 121.92,35.56
  pour Bottom: 97.79,35.56 96.52,36.83 97.79,38.1 97.79,113.03 100.33,113.03 100.33,35.56
  pour Bottom: 76.2,35.56 74.93,36.83 76.2,38.1 76.2,113.03 78.74,113.03 78.74,35.56
  pour Bottom: 54.61,35.56 53.34,36.83 54.61,38.1 54.61,113.03 57.15,113.03 57.15,35.56
  pour Bottom: 33.02,35.56 31.75,36.83 33.02,38.1 33.02,113.03 35.56,113.03 35.56,35.56
  pour Bottom: 11.43,35.56 10.16,36.83 11.43,38.1 11.43,113.03 13.97,113.03 13.97,35.56
  pour Bottom: 119.38,86.36 119.38,89.41 113.03,89.41 113.03,86.36
  pour Bottom: 119.38,60.96 119.38,64.01 113.03,64.01 113.03,60.96
  pour Bottom: 119.38,35.56 119.38,38.61 113.03,38.61 113.03,35.56
  pour Bottom: 97.79,35.56 97.79,38.61 91.44,38.61 91.44,35.56
  pour Bottom: 97.79,60.96 97.79,64.01 91.44,64.01 91.44,60.96
  pour Bottom: 97.79,86.36 97.79,89.41 91.44,89.41 91.44,86.36
  pour Bottom: 76.2,86.36 76.2,89.41 69.85,89.41 69.85,86.36
  pour Bottom: 76.2,60.96 76.2,64.01 69.85,64.01 69.85,60.96
  pour Bottom: 76.2,35.56 76.2,38.61 69.85,38.61 69.85,35.56
  pour Bottom: 54.61,35.56 54.61,38.61 48.26,38.61 48.26,35.56
  pour Bottom: 54.61,60.96 54.61,64.01 48.26,64.01 48.26,60.96
  pour Bottom: 54.61,86.36 54.61,89.41 48.26,89.41 48.26,86.36
  pour Bottom: 33.02,35.56 33.02,38.61 26.67,38.61 26.67,35.56
  pour Bottom: 33.02,60.96 33.02,64.01 26.67,64.01 26.67,60.96
  pour Bottom: 33.02,86.36 33.02,89.41 26.67,89.41 26.67,86.36
  pour Bottom: 11.43,86.36 11.43,89.41 5.08,89.41 5.08,86.36
  pour Bottom: 11.43,60.96 11.43,64.01 5.08,64.01 5.08,60.96
  pour Bottom: 11.43,35.56 11.43,38.61 5.08,38.61 5.08,35.56
  pour Bottom: 1.27,111.76 1.27,115.57 130.81,115.57 130.81,111.76
  pour Bottom: 4.57,30.48 4.57,35.56 122.56,35.56 122.56,30.48
N$1
  Bottom 0.635: U$25.K1 33.02,24.64 33.27,24.38 33.27,14.1 U$1.K2
N$2
  Bottom 0.635: U$25.J1 36.2,24.64 36.45,24.38 36.45,14.1 U$1.J2
N$3
  Bottom 0.635: U$25.H1 39.37,24.64 39.62,24.38 39.62,14.1 U$1.H2
N$4
  Bottom 0.635: U$25.L1 29.84,24.64 30.1,24.38 30.1,14.1 U$1.L2
N$5
  Bottom 0.635: U$25.M1 26.67,24.64 26.92,24.38 26.92,14.1 U$1.M2
N$6
  Bottom 0.635: U$25.N1 23.5,24.64 23.75,24.38 23.75,14.1 U$1.N2
N$7
  Bottom 0.635: U$25.P1 20.32,24.64 20.57,24.38 20.57,14.1 U$1.P2
N$8
  Bottom 0.635: U$25.F1 42.55,24.64 42.8,24.38 42.8,14.1 U$1.F2
N$9
  Bottom 0.635: U$25.E1 45.72,24.64 45.97,24.38 45.97,14.1 U$1.E2
N$10
  Bottom 0.635: U$25.D1 48.9,24.64 49.15,24.38 49.15,14.1 U$1.D2
N$12
  Bottom 0.635: U$25.R1 17.14,24.64 17.4,24.38 17.4,14.1 U$1.R2
N$13
  Bottom 0.635: U$25.S1 13.97,24.64 14.22,24.38 14.22,14.1 U$1.S2
N$14
  Bottom 0.635: U$25.B1 55.24,24.64 55.5,24.38 55.5,14.1 U$1.B2
N$16
  Bottom 0.635: U$25.T1 10.79,24.64 11.05,24.38 11.05,14.1 U$1.T2
N$17
  Bottom 0.635: U$25.U1 7.62,24.64 7.87,24.38 7.87,14.1 U$1.U2
N$18
  Bottom 0.635: U$25.V1 4.45,24.64 4.7,24.38 4.7,20.19 3.56,19.05 3.56,14.1 U$1.V2
N$19
  Top 0.635: U$24.A1 57.15,15.37 58.42,14.1 58.42,13.97 U$1.A1
N$20
  Top 0.635: U$24.V1 3.17,19.81 3.56,19.43 3.56,14.1 U$1.V1
N$21
  Top 0.635: U$24.U1 6.35,15.37 7.62,14.1 7.62,12.7 U$1.U1
N$23
  Top 0.635: U$24.S1 12.7,15.37 13.97,14.1 13.97,12.7 U$1.S1
N$24
  Top 0.635: U$24.R1 15.88,15.37 16.51,14.73 16.51,12.7 U$1.R1
N$25
  Top 0.635: U$24.P1 19.05,15.37 20.32,14.1 20.32,12.7 U$1.P1
N$26
  Top 0.635: U$24.N1 22.23,15.37 22.86,14.73 22.86,13.97 U$1.N1
N$27
  Top 0.635: U$24.M1 25.4,15.37 26.67,14.1 26.67,13.97 U$1.M1
N$28
  Top 0.635: U$24.L1 28.57,15.37 29.21,14.73 29.21,13.97 U$1.L1
N$29
  Top 0.635: U$24.K1 31.75,15.37 33.02,14.1 33.02,13.97 U$1.K1
N$30
  Top 0.635: U$24.J1 34.92,15.37 35.56,14.73 35.56,13.97 U$1.J1
N$31
  Top 0.635: U$24.H1 38.1,15.37 39.37,14.1 39.37,13.97 U$1.H1
N$32
  Top 0.635: U$24.F1 41.27,15.37 41.91,14.73 41.91,13.97 U$1.F1
N$33
  Top 0.635: U$24.E1 44.45,15.37 45.72,14.1 45.72,13.97 U$1.E1
N$34
  Top 0.635: U$24.D1 47.62,15.37 48.26,14.73 48.26,13.97 U$1.D1
N$35
  Top 0.635: U$24.C1 50.8,15.37 52.07,14.1 52.07,13.97 U$1.C1
N$36
  Top 0.635: U$24.B1 53.98,15.37 54.61,14.73 54.61,13.97 U$1.B1
N$37
  Bottom 0.635: U$27.K1 102.87,24.64 103.12,24.38 103.12,14.1 U$6.K2
N$38
  Bottom 0.635: U$27.J1 106.05,24.64 106.3,24.38 106.3,14.1 U$6.J2
N$39
  Bottom 0.635: U$27.H1 109.22,24.64 109.47,24.38 109.47,14.1 U$6.H2
N$40
  Bottom 0.635: U$27.L1 99.69,24.64 99.95,24.38 99.95,14.1 U$6.L2
N$41
  Bottom 0.635: U$27.M1 96.52,24.64 96.77,24.38 96.77,14.1 U$6.M2
N$42
  Bottom 0.635: U$27.N1 93.34,24.64 93.6,24.38 93.6,14.1 U$6.N2
N$43
  Bottom 0.635: U$27.P1 90.17,24.64 90.42,24.38 90.42,14.1 U$6.P2
N$44
  Bottom 0.635: U$27.F1 112.39,24.64 112.65,24.38 112.65,14.1 U$6.F2
N$45
  Bottom 0.635: U$27.E1 115.57,24.64 115.82,24.38 115.82,14.1 U$6.E2
N$46
  Bottom 0.635: U$27.D1 118.75,24.64 119,24.38 119,14.1 U$6.D2
N$48
  Bottom 0.635: U$27.R1 87,24.64 87.25,24.38 87.25,14.1 U$6.R2
N$49
  Bottom 0.635: U$27.S1 83.82,24.64 84.07,24.38 84.07,14.1 U$6.S2
N$50
  Bottom 0.635: U$27.B1 125.09,24.64 125.35,24.38 125.35,14.1 U$6.B2
N$52
  Bottom 0.635: U$27.T1 80.64,24.64 80.9,24.38 80.9,14.1 U$6.T2
N$53
  Bottom 0.635: U$27.U1 77.47,24.64 77.72,24.38 77.72,14.1 U$6.U2
N$54
  Bottom 0.635: U$27.V1 74.3,24.64 74.55,24.38 74.55,20.19 73.41,19.05 73.41,14.1 U$6.V2
N$55
  Top 0.635: U$26.A1 127,15.37 128.27,14.1 128.27,13.97 U$6.A1
N$56
  Top 0.635: U$26.V1 73.03,19.81 73.41,19.43 73.41,14.1 U$6.V1
N$57
  Top 0.635: U$26.U1 76.2,15.37 77.47,14.1 77.47,13.97 U$6.U1
N$59
  Top 0.635: U$26.S1 82.55,15.37 83.82,14.1 83.82,13.97 U$6.S1
N$60
  Top 0.635: U$26.R1 85.72,15.37 86.36,14.73 86.36,13.97 U$6.R1
N$61
  Top 0.635: U$26.P1 88.9,15.37 90.17,14.1 90.17,13.97 U$6.P1
N$62
  Top 0.635: U$26.N1 92.08,15.37 92.71,14.73 92.71,12.7 U$6.N1
N$63
  Top 0.635: U$26.M1 95.25,15.37 96.52,14.1 96.52,13.97 U$6.M1
N$64
  Top 0.635: U$26.L1 98.42,15.37 99.06,14.73 99.06,12.7 U$6.L1
N$65
  Top 0.635: U$26.K1 101.6,15.37 102.87,14.1 102.87,13.97 U$6.K1
N$66
  Top 0.635: U$26.J1 104.78,15.37 105.41,14.73 105.41,13.97 U$6.J1
N$67
  Top 0.635: U$26.H1 107.95,15.37 109.22,14.1 109.22,13.97 U$6.H1
N$68
  Top 0.635: U$26.F1 111.12,15.37 111.76,14.73 111.76,13.97 U$6.F1
N$69
  Top 0.635: U$26.E1 114.3,15.37 115.57,14.1 115.57,13.97 U$6.E1
N$70
  Top 0.635: U$26.D1 117.47,15.37 118.11,14.73 118.11,13.97 U$6.D1
N$71
  Top 0.635: U$26.C1 120.65,15.37 121.92,14.1 121.92,13.97 U$6.C1
N$72
  Top 0.635: U$26.B1 123.83,15.37 124.46,14.73 124.46,13.97 U$6.B1
N$73
  Top 0.635: U$5.1@3 128.27,40.39 U$5.1@2 125.73,40.39 U$5.1
N$74
  Top 0.635: U$5.4@3 128.27,48.01 U$5.4@2 125.73,48.01 U$5.4
N$75
  Top 0.635: U$5.2@3 128.27,42.93 U$5.2@2 125.73,42.93 U$5.2
N$76
  Top 0.635: U$5.3@3 128.27,45.47 U$5.3@2 125.73,45.47 U$5.3
N$77
  Top 0.635: U$5.5@3 128.27,50.55 U$5.5@2 125.73,50.55 U$5.5
N$78
  Top 0.635: U$5.6@3 128.27,53.09 U$5.6@2 125.73,53.09 U$5.6
N$79
  Top 0.635: U$5.7@3 128.27,55.63 U$5.7@2 125.73,55.63 U$5.7
N$80
  Top 0.635: U$5.8@3 128.27,58.17 U$5.8@2 125.73,58.17 U$5.8
N$81
  Top 0.635: U$5.16 115.57,40.39 U$5.16@2 113.03,40.39 U$5.16@3
N$82
  Top 0.635: U$5.15 115.57,42.93 U$5.15@2 113.03,42.93 U$5.15@3
N$83
  Top 0.635: U$5.14 115.57,45.47 U$5.14@2 113.03,45.47 U$5.14@3
N$84
  Top 0.635: U$5.13 115.57,48.01 U$5.13@2 113.03,48.01 U$5.13@3
N$85
  Top 0.635: U$5.12 115.57,50.55 U$5.12@2 113.03,50.55 U$5.12@3
N$86
  Top 0.635: U$5.11 115.57,53.09 U$5.11@2 113.03,53.09 U$5.11@3
N$87
  Top 0.635: U$5.10 115.57,55.63 U$5.10@2 113.03,55.63 U$5.10@3
N$88
  Top 0.635: U$5.9 115.57,58.17 U$5.9@2 113.03,58.17 U$5.9@3
N$89
  Top 0.635: U$7.1@3 128.27,65.79 U$7.1@2 125.73,65.79 U$7.1
N$90
  Top 0.635: U$7.2@3 128.27,68.33 U$7.2@2 125.73,68.33 U$7.2
N$91
  Top 0.635: U$7.3@3 128.27,70.87 U$7.3@2 125.73,70.87 U$7.3
N$92
  Top 0.635: U$7.4@3 128.27,73.41 U$7.4@2 125.73,73.41 U$7.4
N$93
  Top 0.635: U$7.5@3 128.27,75.95 U$7.5@2 125.73,75.95 U$7.5
N$94
  Top 0.635: U$7.6@3 128.27,78.49 U$7.6@2 125.73,78.49 U$7.6
N$95
  Top 0.635: U$7.7@3 128.27,81.03 U$7.7@2 125.73,81.03 U$7.7
N$96
  Top 0.635: U$7.8@3 128.27,83.57 U$7.8@2 125.73,83.57 U$7.8
N$97
  Top 0.635: U$7.16 115.57,65.79 U$7.16@2 113.03,65.79 U$7.16@3
N$98
  Top 0.635: U$7.15 115.57,68.33 U$7.15@2 113.03,68.33 U$7.15@3
N$99
  Top 0.635: U$7.14 115.57,70.87 U$7.14@2 113.03,70.87 U$7.14@3
N$100
  Top 0.635: U$7.13 115.57,73.41 U$7.13@2 113.03,73.41 U$7.13@3
N$101
  Top 0.635: U$7.12 115.57,75.95 U$7.12@2 113.03,75.95 U$7.12@3
N$102
  Top 0.635: U$7.11 115.57,78.49 U$7.11@2 113.03,78.49 U$7.11@3
N$103
  Top 0.635: U$7.10 115.57,81.03 U$7.10@2 113.03,81.03 U$7.10@3
N$104
  Top 0.635: U$7.9 115.57,83.57 U$7.9@2 113.03,83.57 U$7.9@3
N$105
  Top 0.635: U$8.1@3 128.27,91.19 U$8.1@2 125.73,91.19 U$8.1
N$106
  Top 0.635: U$8.2@3 128.27,93.73 U$8.2@2 125.73,93.73 U$8.2
N$107
  Top 0.635: U$8.3@3 128.27,96.27 U$8.3@2 125.73,96.27 U$8.3
N$108
  Top 0.635: U$8.4@3 128.27,98.81 U$8.4@2 125.73,98.81 U$8.4
N$109
  Top 0.635: U$8.5@3 128.27,101.35 U$8.5@2 125.73,101.35 U$8.5
N$110
  Top 0.635: U$8.6@3 128.27,103.89 U$8.6@2 125.73,103.89 U$8.6
N$111
  Top 0.635: U$8.7@3 128.27,106.43 U$8.7@2 125.73,106.43 U$8.7
N$112
  Top 0.635: U$8.8@3 128.27,108.97 U$8.8@2 125.73,108.97 U$8.8
N$113
  Top 0.635: U$8.16 115.57,91.19 U$8.16@2 113.03,91.19 U$8.16@3
N$114
  Top 0.635: U$8.15 115.57,93.73 U$8.15@2 113.03,93.73 U$8.15@3
N$115
  Top 0.635: U$8.14 115.57,96.27 U$8.14@2 113.03,96.27 U$8.14@3
N$116
  Top 0.635: U$8.13 115.57,98.81 U$8.13@2 113.03,98.81 U$8.13@3
N$117
  Top 0.635: U$8.12 115.57,101.35 U$8.12@2 113.03,101.35 U$8.12@3
N$118
  Top 0.635: U$8.11 115.57,103.89 U$8.11@2 113.03,103.89 U$8.11@3
N$119
  Top 0.635: U$8.10 115.57,106.43 U$8.10@2 113.03,106.43 U$8.10@3
N$120
  Top 0.635: U$8.9 115.57,108.97 U$8.9@2 113.03,108.97 U$8.9@3
N$121
  Top 0.635: U$9.1@3 106.68,40.39 U$9.1@2 104.14,40.39 U$9.1
N$122
  Top 0.635: U$9.2@3 106.68,42.93 U$9.2@2 104.14,42.93 U$9.2
N$123
  Top 0.635: U$9.3@3 106.68,45.47 U$9.3@2 104.14,45.47 U$9.3
N$124
  Top 0.635: U$9.4@3 106.68,48.01 U$9.4@2 104.14,48.01 U$9.4
N$125
  Top 0.635: U$9.5@3 106.68,50.55 U$9.5@2 104.14,50.55 U$9.5
N$126
  Top 0.635: U$9.6@3 106.68,53.09 U$9.6@2 104.14,53.09 U$9.6
N$127
  Top 0.635: U$9.7@3 106.68,55.63 U$9.7@2 104.14,55.63 U$9.7
N$128
  Top 0.635: U$9.8@3 106.68,58.17 U$9.8@2 104.14,58.17 U$9.8
N$129
  Top 0.635: U$9.16 93.98,40.39 U$9.16@2 91.44,40.39 U$9.16@3
N$130
  Top 0.635: U$9.15 93.98,42.93 U$9.15@2 91.44,42.93 U$9.15@3
N$131
  Top 0.635: U$9.14 93.98,45.47 U$9.14@2 91.44,45.47 U$9.14@3
N$132
  Top 0.635: U$9.13 93.98,48.01 U$9.13@2 91.44,48.01 U$9.13@3
N$133
  Top 0.635: U$9.12 93.98,50.55 U$9.12@2 91.44,50.55 U$9.12@3
N$134
  Top 0.635: U$9.11 93.98,53.09 U$9.11@2 91.44,53.09 U$9.11@3
N$135
  Top 0.635: U$9.10 93.98,55.63 U$9.10@2 91.44,55.63 U$9.10@3
N$136
  Top 0.635: U$9.9 93.98,58.17 U$9.9@2 91.44,58.17 U$9.9@3
N$137
  Top 0.635: U$10.1@3 106.68,65.79 U$10.1@2 104.14,65.79 U$10.1
N$138
  Top 0.635: U$10.2@3 106.68,68.33 U$10.2@2 104.14,68.33 U$10.2
N$139
  Top 0.635: U$10.3@3 106.68,70.87 U$10.3@2 104.14,70.87 U$10.3
N$140
  Top 0.635: U$10.4@3 106.68,73.41 U$10.4@2 104.14,73.41 U$10.4
N$141
  Top 0.635: U$10.5@3 106.68,75.95 U$10.5@2 104.14,75.95 U$10.5
N$142
  Top 0.635: U$10.6@3 106.68,78.49 U$10.6@2 104.14,78.49 U$10.6
N$143
  Top 0.635: U$10.7@3 106.68,81.03 U$10.7@2 104.14,81.03 U$10.7
N$144
  Top 0.635: U$10.8@3 106.68,83.57 U$10.8@2 104.14,83.57 U$10.8
N$145
  Top 0.635: U$10.16 93.98,65.79 U$10.16@2 91.44,65.79 U$10.16@3
N$146
  Top 0.635: U$10.15 93.98,68.33 U$10.15@2 91.44,68.33 U$10.15@3
N$147
  Top 0.635: U$10.14 93.98,70.87 U$10.14@2 91.44,70.87 U$10.14@3
N$148
  Top 0.635: U$10.13 93.98,73.41 U$10.13@2 91.44,73.41 U$10.13@3
N$149
  Top 0.635: U$10.12 93.98,75.95 U$10.12@2 91.44,75.95 U$10.12@3
N$150
  Top 0.635: U$10.11 93.98,78.49 U$10.11@2 91.44,78.49 U$10.11@3
N$151
  Top 0.635: U$10.10 93.98,81.03 U$10.10@2 91.44,81.03 U$10.10@3
N$152
  Top 0.635: U$10.9 93.98,83.57 U$10.9@2 91.44,83.57 U$10.9@3
N$153
  Top 0.635: U$11.1@3 106.68,91.19 U$11.1@2 104.14,91.19 U$11.1
N$154
  Top 0.635: U$11.2@3 106.68,93.73 U$11.2@2 104.14,93.73 U$11.2
N$155
  Top 0.635: U$11.3@3 106.68,96.27 U$11.3@2 104.14,96.27 U$11.3
N$156
  Top 0.635: U$11.4@3 106.68,98.81 U$11.4@2 104.14,98.81 U$11.4
N$157
  Top 0.635: U$11.5@3 106.68,101.35 U$11.5@2 104.14,101.35 U$11.5
N$158
  Top 0.635: U$11.6@3 106.68,103.89 U$11.6@2 104.14,103.89 U$11.6
N$159
  Top 0.635: U$11.7@3 106.68,106.43 U$11.7@2 104.14,106.43 U$11.7
N$160
  Top 0.635: U$11.8@3 106.68,108.97 U$11.8@2 104.14,108.97 U$11.8
N$161
  Top 0.635: U$11.16 93.98,91.19 U$11.16@2 91.44,91.19 U$11.16@3
N$162
  Top 0.635: U$11.15 93.98,93.73 U$11.15@2 91.44,93.73 U$11.15@3
N$163
  Top 0.635: U$11.14 93.98,96.27 U$11.14@2 91.44,96.27 U$11.14@3
N$164
  Top 0.635: U$11.13 93.98,98.81 U$11.13@2 91.44,98.81 U$11.13@3
N$165
  Top 0.635: U$11.12 93.98,101.35 U$11.12@2 91.44,101.35 U$11.12@3
N$166
  Top 0.635: U$11.11 93.98,103.89 U$11.11@2 91.44,103.89 U$11.11@3
N$167
  Top 0.635: U$11.10 93.98,106.43 U$11.10@2 91.44,106.43 U$11.10@3
N$168
  Top 0.635: U$11.9 93.98,108.97 U$11.9@2 91.44,108.97 U$11.9@3
N$169
  Top 0.635: U$12.1@3 85.09,40.39 U$12.1@2 82.55,40.39 U$12.1
N$170
  Top 0.635: U$12.2@3 85.09,42.93 U$12.2@2 82.55,42.93 U$12.2
N$171
  Top 0.635: U$12.3@3 85.09,45.47 U$12.3@2 82.55,45.47 U$12.3
N$172
  Top 0.635: U$12.4@3 85.09,48.01 U$12.4@2 82.55,48.01 U$12.4
N$173
  Top 0.635: U$12.5@3 85.09,50.55 U$12.5@2 82.55,50.55 U$12.5
N$174
  Top 0.635: U$12.6@3 85.09,53.09 U$12.6@2 82.55,53.09 U$12.6
N$175
  Top 0.635: U$12.7@3 85.09,55.63 U$12.7@2 82.55,55.63 U$12.7
N$176
  Top 0.635: U$12.8@3 85.09,58.17 U$12.8@2 82.55,58.17 U$12.8
N$177
  Top 0.635: U$12.16 72.39,40.39 U$12.16@2 69.85,40.39 U$12.16@3
N$178
  Top 0.635: U$12.15 72.39,42.93 U$12.15@2 69.85,42.93 U$12.15@3
N$179
  Top 0.635: U$12.14 72.39,45.47 U$12.14@2 69.85,45.47 U$12.14@3
N$180
  Top 0.635: U$12.13 72.39,48.01 U$12.13@2 69.85,48.01 U$12.13@3
N$181
  Top 0.635: U$12.12 72.39,50.55 U$12.12@2 69.85,50.55 U$12.12@3
N$182
  Top 0.635: U$12.11 72.39,53.09 U$12.11@2 69.85,53.09 U$12.11@3
N$183
  Top 0.635: U$12.10 72.39,55.63 U$12.10@2 69.85,55.63 U$12.10@3
N$184
  Top 0.635: U$12.9 72.39,58.17 U$12.9@2 69.85,58.17 U$12.9@3
N$185
  Top 0.635: U$13.1@3 85.09,65.79 U$13.1@2 82.55,65.79 U$13.1
N$186
  Top 0.635: U$13.2@3 85.09,68.33 U$13.2@2 82.55,68.33 U$13.2
N$187
  Top 0.635: U$13.3@3 85.09,70.87 U$13.3@2 82.55,70.87 U$13.3
N$188
  Top 0.635: U$13.4@3 85.09,73.41 U$13.4@2 82.55,73.41 U$13.4
N$189
  Top 0.635: U$13.5@3 85.09,75.95 U$13.5@2 82.55,75.95 U$13.5
N$190
  Top 0.635: U$13.6@3 85.09,78.49 U$13.6@2 82.55,78.49 U$13.6
N$191
  Top 0.635: U$13.7@3 85.09,81.03 U$13.7@2 82.55,81.03 U$13.7
N$192
  Top 0.635: U$13.8@3 85.09,83.57 U$13.8@2 82.55,83.57 U$13.8
N$193
  Top 0.635: U$13.16 72.39,65.79 U$13.16@2 69.85,65.79 U$13.16@3
N$194
  Top 0.635: U$13.15 72.39,68.33 U$13.15@2 69.85,68.33 U$13.15@3
N$195
  Top 0.635: U$13.14 72.39,70.87 U$13.14@2 69.85,70.87 U$13.14@3
N$196
  Top 0.635: U$13.13 72.39,73.41 U$13.13@2 69.85,73.41 U$13.13@3
N$197
  Top 0.635: U$13.12 72.39,75.95 U$13.12@2 69.85,75.95 U$13.12@3
N$198
  Top 0.635: U$13.11 72.39,78.49 U$13.11@2 69.85,78.49 U$13.11@3
N$199
  Top 0.635: U$13.10 72.39,81.03 U$13.10@2 69.85,81.03 U$13.10@3
N$200
  Top 0.635: U$13.9 72.39,83.57 U$13.9@2 69.85,83.57 U$13.9@3
N$201
  Top 0.635: U$14.1@3 85.09,91.19 U$14.1@2 82.55,91.19 U$14.1
N$202
  Top 0.635: U$14.2@3 85.09,93.73 U$14.2@2 82.55,93.73 U$14.2
N$203
  Top 0.635: U$14.3@3 85.09,96.27 U$14.3@2 82.55,96.27 U$14.3
N$204
  Top 0.635: U$14.4@3 85.09,98.81 U$14.4@2 82.55,98.81 U$14.4
N$205
  Top 0.635: U$14.5@3 85.09,101.35 U$14.5@2 82.55,101.35 U$14.5
N$206
  Top 0.635: U$14.6@3 85.09,103.89 U$14.6@2 82.55,103.89 U$14.6
N$207
  Top 0.635: U$14.7@3 85.09,106.43 U$14.7@2 82.55,106.43 U$14.7
N$208
  Top 0.635: U$14.8@3 85.09,108.97 U$14.8@2 82.55,108.97 U$14.8
N$209
  Top 0.635: U$14.16 72.39,91.19 U$14.16@2 69.85,91.19 U$14.16@3
N$210
  Top 0.635: U$14.15 72.39,93.73 U$14.15@2 69.85,93.73 U$14.15@3
N$211
  Top 0.635: U$14.14 72.39,96.27 U$14.14@2 69.85,96.27 U$14.14@3
N$212
  Top 0.635: U$14.13 72.39,98.81 U$14.13@2 69.85,98.81 U$14.13@3
N$213
  Top 0.635: U$14.12 72.39,101.35 U$14.12@2 69.85,101.35 U$14.12@3
N$214
  Top 0.635: U$14.11 72.39,103.89 U$14.11@2 69.85,103.89 U$14.11@3
N$215
  Top 0.635: U$14.10 72.39,106.43 U$14.10@2 69.85,106.43 U$14.10@3
N$216
  Top 0.635: U$14.9 72.39,108.97 U$14.9@2 69.85,108.97 U$14.9@3
N$217
  Top 0.635: U$15.1@3 63.5,40.39 U$15.1@2 60.96,40.39 U$15.1
N$218
  Top 0.635: U$15.2@3 63.5,42.93 U$15.2@2 60.96,42.93 U$15.2
N$219
  Top 0.635: U$15.3@3 63.5,45.47 U$15.3@2 60.96,45.47 U$15.3
N$220
  Top 0.635: U$15.4@3 63.5,48.01 U$15.4@2 60.96,48.01 U$15.4
N$221
  Top 0.635: U$15.5@3 63.5,50.55 U$15.5@2 60.96,50.55 U$15.5
N$222
  Top 0.635: U$15.6@3 63.5,53.09 U$15.6@2 60.96,53.09 U$15.6
N$223
  Top 0.635: U$15.7@3 63.5,55.63 U$15.7@2 60.96,55.63 U$15.7
N$224
  Top 0.635: U$15.8@3 63.5,58.17 U$15.8@2 60.96,58.17 U$15.8
N$225
  Top 0.635: U$15.16 50.8,40.39 U$15.16@2 48.26,40.39 U$15.16@3
N$226
  Top 0.635: U$15.15 50.8,42.93 U$15.15@2 48.26,42.93 U$15.15@3
N$227
  Top 0.635: U$15.14 50.8,45.47 U$15.14@2 48.26,45.47 U$15.14@3
N$228
  Top 0.635: U$15.13 50.8,48.01 U$15.13@2 48.26,48.01 U$15.13@3
N$229
  Top 0.635: U$15.12 50.8,50.55 U$15.12@2 48.26,50.55 U$15.12@3
N$230
  Top 0.635: U$15.11 50.8,53.09 U$15.11@2 48.26,53.09 U$15.11@3
N$231
  Top 0.635: U$15.10 50.8,55.63 U$15.10@2 48.26,55.63 U$15.10@3
N$232
  Top 0.635: U$15.9 50.8,58.17 U$15.9@2 48.26,58.17 U$15.9@3
N$233
  Top 0.635: U$16.1@3 63.5,65.79 U$16.1@2 60.96,65.79 U$16.1
N$234
  Top 0.635: U$16.2@3 63.5,68.33 U$16.2@2 60.96,68.33 U$16.2
N$235
  Top 0.635: U$16.3@3 63.5,70.87 U$16.3@2 60.96,70.87 U$16.3
N$236
  Top 0.635: U$16.4@3 63.5,73.41 U$16.4@2 60.96,73.41 U$16.4
N$237
  Top 0.635: U$16.5@3 63.5,75.95 U$16.5@2 60.96,75.95 U$16.5
N$238
  Top 0.635: U$16.6@3 63.5,78.49 U$16.6@2 60.96,78.49 U$16.6
N$239
  Top 0.635: U$16.7@3 63.5,81.03 U$16.7@2 60.96,81.03 U$16.7
N$240
  Top 0.635: U$16.8@3 63.5,83.57 U$16.8@2 60.96,83.57 U$16.8
N$241
  Top 0.635: U$16.16 50.8,65.79 U$16.16@2 48.26,65.79 U$16.16@3
N$242
  Top 0.635: U$16.15 50.8,68.33 U$16.15@2 48.26,68.33 U$16.15@3
N$243
  Top 0.635: U$16.14 50.8,70.87 U$16.14@2 48.26,70.87 U$16.14@3
N$244
  Top 0.635: U$16.13 50.8,73.41 U$16.13@2 48.26,73.41 U$16.13@3
N$245
  Top 0.635: U$16.12 50.8,75.95 U$16.12@2 48.26,75.95 U$16.12@3
N$246
  Top 0.635: U$16.11 50.8,78.49 U$16.11@2 48.26,78.49 U$16.11@3
N$247
  Top 0.635: U$16.10 50.8,81.03 U$16.10@2 48.26,81.03 U$16.10@3
N$248
  Top 0.635: U$16.9 50.8,83.57 U$16.9@2 48.26,83.57 U$16.9@3
N$249
  Top 0.635: U$17.1@3 63.5,91.19 U$17.1@2 60.96,91.19 U$17.1
N$250
  Top 0.635: U$17.2@3 63.5,93.73 U$17.2@2 60.96,93.73 U$17.2
N$251
  Top 0.635: U$17.3@3 63.5,96.27 U$17.3@2 60.96,96.27 U$17.3
N$252
  Top 0.635: U$17.4@3 63.5,98.81 U$17.4@2 60.96,98.81 U$17.4
N$253
  Top 0.635: U$17.5@3 63.5,101.35 U$17.5@2 60.96,101.35 U$17.5
N$254
  Top 0.635: U$17.6@3 63.5,103.89 U$17.6@2 60.96,103.89 U$17.6
N$255
  Top 0.635: U$17.7@3 63.5,106.43 U$17.7@2 60.96,106.43 U$17.7
N$256
  Top 0.635: U$17.8@3 63.5,108.97 U$17.8@2 60.96,108.97 U$17.8
N$257
  Top 0.635: U$17.16 50.8,91.19 U$17.16@2 48.26,91.19 U$17.16@3
N$258
  Top 0.635: U$17.15 50.8,93.73 U$17.15@2 48.26,93.73 U$17.15@3
N$259
  Top 0.635: U$17.14 50.8,96.27 U$17.14@2 48.26,96.27 U$17.14@3
N$260
  Top 0.635: U$17.13 50.8,98.81 U$17.13@2 48.26,98.81 U$17.13@3
N$261
  Top 0.635: U$17.12 50.8,101.35 U$17.12@2 48.26,101.35 U$17.12@3
N$262
  Top 0.635: U$17.11 50.8,103.89 U$17.11@2 48.26,103.89 U$17.11@3
N$263
  Top 0.635: U$17.10 50.8,106.43 U$17.10@2 48.26,106.43 U$17.10@3
N$264
  Top 0.635: U$17.9 50.8,108.97 U$17.9@2 48.26,108.97 U$17.9@3
N$265
  Top 0.635: U$18.1@3 41.91,40.39 U$18.1@2 39.37,40.39 U$18.1
N$266
  Top 0.635: U$18.2@3 41.91,42.93 U$18.2@2 39.37,42.93 U$18.2
N$267
  Top 0.635: U$18.3@3 41.91,45.47 U$18.3@2 39.37,45.47 U$18.3
N$268
  Top 0.635: U$18.4@3 41.91,48.01 U$18.4@2 39.37,48.01 U$18.4
N$269
  Top 0.635: U$18.5@3 41.91,50.55 U$18.5@2 39.37,50.55 U$18.5
N$270
  Top 0.635: U$18.6@3 41.91,53.09 U$18.6@2 39.37,53.09 U$18.6
N$271
  Top 0.635: U$18.7@3 41.91,55.63 U$18.7@2 39.37,55.63 U$18.7
N$272
  Top 0.635: U$18.8@3 41.91,58.17 U$18.8@2 39.37,58.17 U$18.8
N$273
  Top 0.635: U$18.16 29.21,40.39 U$18.16@2 26.67,40.39 U$18.16@3
N$274
  Top 0.635: U$18.15 29.21,42.93 U$18.15@2 26.67,42.93 U$18.15@3
N$275
  Top 0.635: U$18.14 29.21,45.47 U$18.14@2 26.67,45.47 U$18.14@3
N$276
  Top 0.635: U$18.13 29.21,48.01 U$18.13@2 26.67,48.01 U$18.13@3
N$277
  Top 0.635: U$18.12 29.21,50.55 U$18.12@2 26.67,50.55 U$18.12@3
N$278
  Top 0.635: U$18.11 29.21,53.09 U$18.11@2 26.67,53.09 U$18.11@3
N$279
  Top 0.635: U$18.10 29.21,55.63 U$18.10@2 26.67,55.63 U$18.10@3
N$280
  Top 0.635: U$18.9 29.21,58.17 U$18.9@2 26.67,58.17 U$18.9@3
N$281
  Top 0.635: U$19.1@3 41.91,65.79 U$19.1@2 39.37,65.79 U$19.1
N$282
  Top 0.635: U$19.2@3 41.91,68.33 U$19.2@2 39.37,68.33 U$19.2
N$283
  Top 0.635: U$19.3@3 41.91,70.87 U$19.3@2 39.37,70.87 U$19.3
N$284
  Top 0.635: U$19.4@3 41.91,73.41 U$19.4@2 39.37,73.41 U$19.4
N$285
  Top 0.635: U$19.5@3 41.91,75.95 U$19.5@2 39.37,75.95 U$19.5
N$286
  Top 0.635: U$19.6@3 41.91,78.49 U$19.6@2 39.37,78.49 U$19.6
N$287
  Top 0.635: U$19.7@3 41.91,81.03 U$19.7@2 39.37,81.03 U$19.7
N$288
  Top 0.635: U$19.8@3 41.91,83.57 U$19.8@2 39.37,83.57 U$19.8
N$289
  Top 0.635: U$19.16 29.21,65.79 U$19.16@2 26.67,65.79 U$19.16@3
N$290
  Top 0.635: U$19.15 29.21,68.33 U$19.15@2 26.67,68.33 U$19.15@3
N$291
  Top 0.635: U$19.14 29.21,70.87 U$19.14@2 26.67,70.87 U$19.14@3
N$292
  Top 0.635: U$19.13 29.21,73.41 U$19.13@2 26.67,73.41 U$19.13@3
N$293
  Top 0.635: U$19.12 29.21,75.95 U$19.12@2 26.67,75.95 U$19.12@3
N$294
  Top 0.635: U$19.11 29.21,78.49 U$19.11@2 26.67,78.49 U$19.11@3
N$295
  Top 0.635: U$19.10 29.21,81.03 U$19.10@2 26.67,81.03 U$19.10@3
N$296
  Top 0.635: U$19.9 29.21,83.57 U$19.9@2 26.67,83.57 U$19.9@3
N$297
  Top 0.635: U$20.1@3 41.91,91.19 U$20.1@2 39.37,91.19 U$20.1
N$298
  Top 0.635: U$20.2@3 41.91,93.73 U$20.2@2 39.37,93.73 U$20.2
N$299
  Top 0.635: U$20.3@3 41.91,96.27 U$20.3@2 39.37,96.27 U$20.3
N$300
  Top 0.635: U$20.4@3 41.91,98.81 U$20.4@2 39.37,98.81 U$20.4
N$301
  Top 0.635: U$20.5@3 41.91,101.35 U$20.5@2 39.37,101.35 U$20.5
N$302
  Top 0.635: U$20.6@3 41.91,103.89 U$20.6@2 39.37,103.89 U$20.6
N$303
  Top 0.635: U$20.7@3 41.91,106.43 U$20.7@2 39.37,106.43 U$20.7
N$304
  Top 0.635: U$20.8@3 41.91,108.97 U$20.8@2 39.37,108.97 U$20.8
N$305
  Top 0.635: U$20.16 29.21,91.19 U$20.16@2 26.67,91.19 U$20.16@3
N$306
  Top 0.635: U$20.15 29.21,93.73 U$20.15@2 26.67,93.73 U$20.15@3
N$307
  Top 0.635: U$20.14 29.21,96.27 U$20.14@2 26.67,96.27 U$20.14@3
N$308
  Top 0.635: U$20.13 29.21,98.81 U$20.13@2 26.67,98.81 U$20.13@3
N$309
  Top 0.635: U$20.12 29.21,101.35 U$20.12@2 26.67,101.35 U$20.12@3
N$310
  Top 0.635: U$20.11 29.21,103.89 U$20.11@2 26.67,103.89 U$20.11@3
N$311
  Top 0.635: U$20.10 29.21,106.43 U$20.10@2 26.67,106.43 U$20.10@3
N$312
  Top 0.635: U$20.9 29.21,108.97 U$20.9@2 26.67,108.97 U$20.9@3
N$313
  Top 0.635: U$21.1@3 20.32,40.39 U$21.1@2 17.78,40.39 U$21.1
N$314
  Top 0.635: U$21.2@3 20.32,42.93 U$21.2@2 17.78,42.93 U$21.2
N$315
  Top 0.635: U$21.3@3 20.32,45.47 U$21.3@2 17.78,45.47 U$21.3
N$316
  Top 0.635: U$21.4@3 20.32,48.01 U$21.4@2 17.78,48.01 U$21.4
N$317
  Top 0.635: U$21.5@3 20.32,50.55 U$21.5@2 17.78,50.55 U$21.5
N$318
  Top 0.635: U$21.6@3 20.32,53.09 U$21.6@2 17.78,53.09 U$21.6
N$319
  Top 0.635: U$21.7@3 20.32,55.63 U$21.7@2 17.78,55.63 U$21.7
N$320
  Top 0.635: U$21.8@3 20.32,58.17 U$21.8@2 17.78,58.17 U$21.8
N$321
  Top 0.635: U$21.16 7.62,40.39 U$21.16@2 5.08,40.39 U$21.16@3
N$322
  Top 0.635: U$21.15 7.62,42.93 U$21.15@2 5.08,42.93 U$21.15@3
N$323
  Top 0.635: U$21.14 7.62,45.47 U$21.14@2 5.08,45.47 U$21.14@3
N$324
  Top 0.635: U$21.13 7.62,48.01 U$21.13@2 5.08,48.01 U$21.13@3
N$325
  Top 0.635: U$21.12 7.62,50.55 U$21.12@2 5.08,50.55 U$21.12@3
N$326
  Top 0.635: U$21.11 7.62,53.09 U$21.11@2 5.08,53.09 U$21.11@3
N$327
  Top 0.635: U$21.10 7.62,55.63 U$21.10@2 5.08,55.63 U$21.10@3
N$328
  Top 0.635: U$21.9 7.62,58.17 U$21.9@2 5.08,58.17 U$21.9@3
N$329
  Top 0.635: U$22.1@3 20.32,65.79 U$22.1@2 17.78,65.79 U$22.1
N$330
  Top 0.635: U$22.2@3 20.32,68.33 U$22.2@2 17.78,68.33 U$22.2
N$331
  Top 0.635: U$22.3@3 20.32,70.87 U$22.3@2 17.78,70.87 U$22.3
N$332
  Top 0.635: U$22.4@3 20.32,73.41 U$22.4@2 17.78,73.41 U$22.4
N$333
  Top 0.635: U$22.5@3 20.32,75.95 U$22.5@2 17.78,75.95 U$22.5
N$334
  Top 0.635: U$22.6@3 20.32,78.49 U$22.6@2 17.78,78.49 U$22.6
N$335
  Top 0.635: U$22.7@3 20.32,81.03 U$22.7@2 17.78,81.03 U$22.7
N$336
  Top 0.635: U$22.8@3 20.32,83.57 U$22.8@2 17.78,83.57 U$22.8
N$337
  Top 0.635: U$22.16 7.62,65.79 U$22.16@2 5.08,65.79 U$22.16@3
N$338
  Top 0.635: U$22.15 7.62,68.33 U$22.15@2 5.08,68.33 U$22.15@3
N$339
  Top 0.635: U$22.14 7.62,70.87 U$22.14@2 5.08,70.87 U$22.14@3
N$340
  Top 0.635: U$22.13 7.62,73.41 U$22.13@2 5.08,73.41 U$22.13@3
N$341
  Top 0.635: U$22.12 7.62,75.95 U$22.12@2 5.08,75.95 U$22.12@3
N$342
  Top 0.635: U$22.11 7.62,78.49 U$22.11@2 5.08,78.49 U$22.11@3
N$343
  Top 0.635: U$22.10 7.62,81.03 U$22.10@2 5.08,81.03 U$22.10@3
N$344
  Top 0.635: U$22.9 7.62,83.57 U$22.9@2 5.08,83.57 U$22.9@3
N$345
  Top 0.635: U$23.1@3 20.32,91.19 U$23.1@2 17.78,91.19 U$23.1
N$346
  Top 0.635: U$23.2@3 20.32,93.73 U$23.2@2 17.78,93.73 U$23.2
N$347
  Top 0.635: U$23.3@3 20.32,96.27 U$23.3@2 17.78,96.27 U$23.3
N$348
  Top 0.635: U$23.4@3 20.32,98.81 U$23.4@2 17.78,98.81 U$23.4
N$349
  Top 0.635: U$23.5@3 20.32,101.35 U$23.5@2 17.78,101.35 U$23.5
N$350
  Top 0.635: U$23.6@3 20.32,103.89 U$23.6@2 17.78,103.89 U$23.6
N$351
  Top 0.635: U$23.7@3 20.32,106.43 U$23.7@2 17.78,106.43 U$23.7
N$352
  Top 0.635: U$23.8@3 20.32,108.97 U$23.8@2 17.78,108.97 U$23.8
N$353
  Top 0.635: U$23.16 7.62,91.19 U$23.16@2 5.08,91.19 U$23.16@3
N$354
  Top 0.635: U$23.15 7.62,93.73 U$23.15@2 5.08,93.73 U$23.15@3
N$355
  Top 0.635: U$23.14 7.62,96.27 U$23.14@2 5.08,96.27 U$23.14@3
N$356
  Top 0.635: U$23.13 7.62,98.81 U$23.13@2 5.08,98.81 U$23.13@3
N$357
  Top 0.635: U$23.12 7.62,101.35 U$23.12@2 5.08,101.35 U$23.12@3
N$358
  Top 0.635: U$23.11 7.62,103.89 U$23.11@2 5.08,103.89 U$23.11@3
N$359
  Top 0.635: U$23.10 7.62,106.43 U$23.10@2 5.08,106.43 U$23.10@3
N$360
  Top 0.635: U$23.9 7.62,108.97 U$23.9@2 5.08,108.97 U$23.9@3
VCC  (via drill 1.27)
  Top 0.635: U$25.A1 58.42,31.75 | U$27.A1 128.27,31.75
  Bottom 0.635: U$1.A2 58.67,14.1 58.67,25.4 58.42,25.65 U$25.A1 | U$6.A2 128.52,14.1 128.52,25.4 128.27,25.65 U$27.A1
  other vias: 105.41,62.23 101.6,62.23 101.6,87.63 105.41,87.63 101.6,36.83 105.41,36.83 123.19,36.83 127,36.83 123.19,62.23 127,62.23 127,87.63 123.19,87.63 80.01,36.83 80.01,62.23 80.01,87.63 83.82,87.63 83.82,62.23 83.82,36.83 58.42,36.83 62.23,36.83 62.23,62.23 62.23,87.63 58.42,62.23 58.42,87.63 40.64,36.83 40.64,62.23 40.64,87.63 36.83,87.63 36.83,62.23 36.83,36.83 15.24,36.83 15.24,62.23 15.24,87.63 19.05,87.63 19.05,62.23 19.05,36.83 19.05,113.03
  pour Top: 10.92,30.48 10.92,35.56 128.78,35.56 128.78,30.48
  pour Top: 1.27,111.76 1.27,124.46 130.81,124.46 130.81,111.76
  pour Top: 11.43,35.56 11.43,113.03 13.97,113.03 13.97,38.1 15.24,36.83 13.97,35.56
  pour Top: 33.02,35.56 33.02,113.03 35.56,113.03 35.56,38.1 36.83,36.83 35.56,35.56
  pour Top: 54.61,35.56 54.61,113.03 57.15,113.03 57.15,38.1 58.42,36.83 57.15,35.56
  pour Top: 76.2,35.56 76.2,113.03 78.74,113.03 78.74,38.1 80.01,36.83 78.74,35.56
  pour Top: 97.79,35.56 97.79,113.03 100.33,113.03 100.33,38.1 101.6,36.83 100.33,35.56
  pour Top: 119.38,35.56 119.38,113.03 121.92,113.03 121.92,38.1 123.19,36.83 121.92,35.56
  pour Top: 106.68,60.96 106.68,64.01 100.33,64.01 100.33,60.96
  pour Top: 106.68,86.36 106.68,89.41 100.33,89.41 100.33,86.36
  pour Top: 128.27,60.96 128.27,64.01 121.92,64.01 121.92,60.96
  pour Top: 128.27,86.36 128.27,89.41 121.92,89.41 121.92,86.36
  pour Top: 128.27,35.56 128.27,38.61 121.92,38.61 121.92,35.56
  pour Top: 106.68,35.56 106.68,38.61 100.33,38.61 100.33,35.56
  pour Top: 85.09,35.56 85.09,38.61 78.74,38.61 78.74,35.56
  pour Top: 85.09,60.96 85.09,64.01 78.74,64.01 78.74,60.96
  pour Top: 85.09,86.36 85.09,89.41 78.74,89.41 78.74,86.36
  pour Top: 63.5,35.56 63.5,38.61 57.15,38.61 57.15,35.56
  pour Top: 63.5,60.96 63.5,64.01 57.15,64.01 57.15,60.96
  pour Top: 63.5,86.36 63.5,89.41 57.15,89.41 57.15,86.36
  pour Top: 41.91,86.36 41.91,89.41 35.56,89.41 35.56,86.36
  pour Top: 41.91,60.96 41.91,64.01 35.56,64.01 35.56,60.96
  pour Top: 41.91,35.56 41.91,38.61 35.56,38.61 35.56,35.56
  pour Top: 20.32,35.56 20.32,38.61 13.97,38.61 13.97,35.56
  pour Top: 20.32,60.96 20.32,64.01 13.97,64.01 13.97,60.96
  pour Top: 20.32,86.36 20.32,89.41 13.97,89.41 13.97,86.36

### Text on the board
tRestrict: DOUGLAS ELECTRONICS, INC. | 10-DE-77 | Vcc
bRestrict: GND